# Altium project Tundra_PCB_Project.PrjPcb
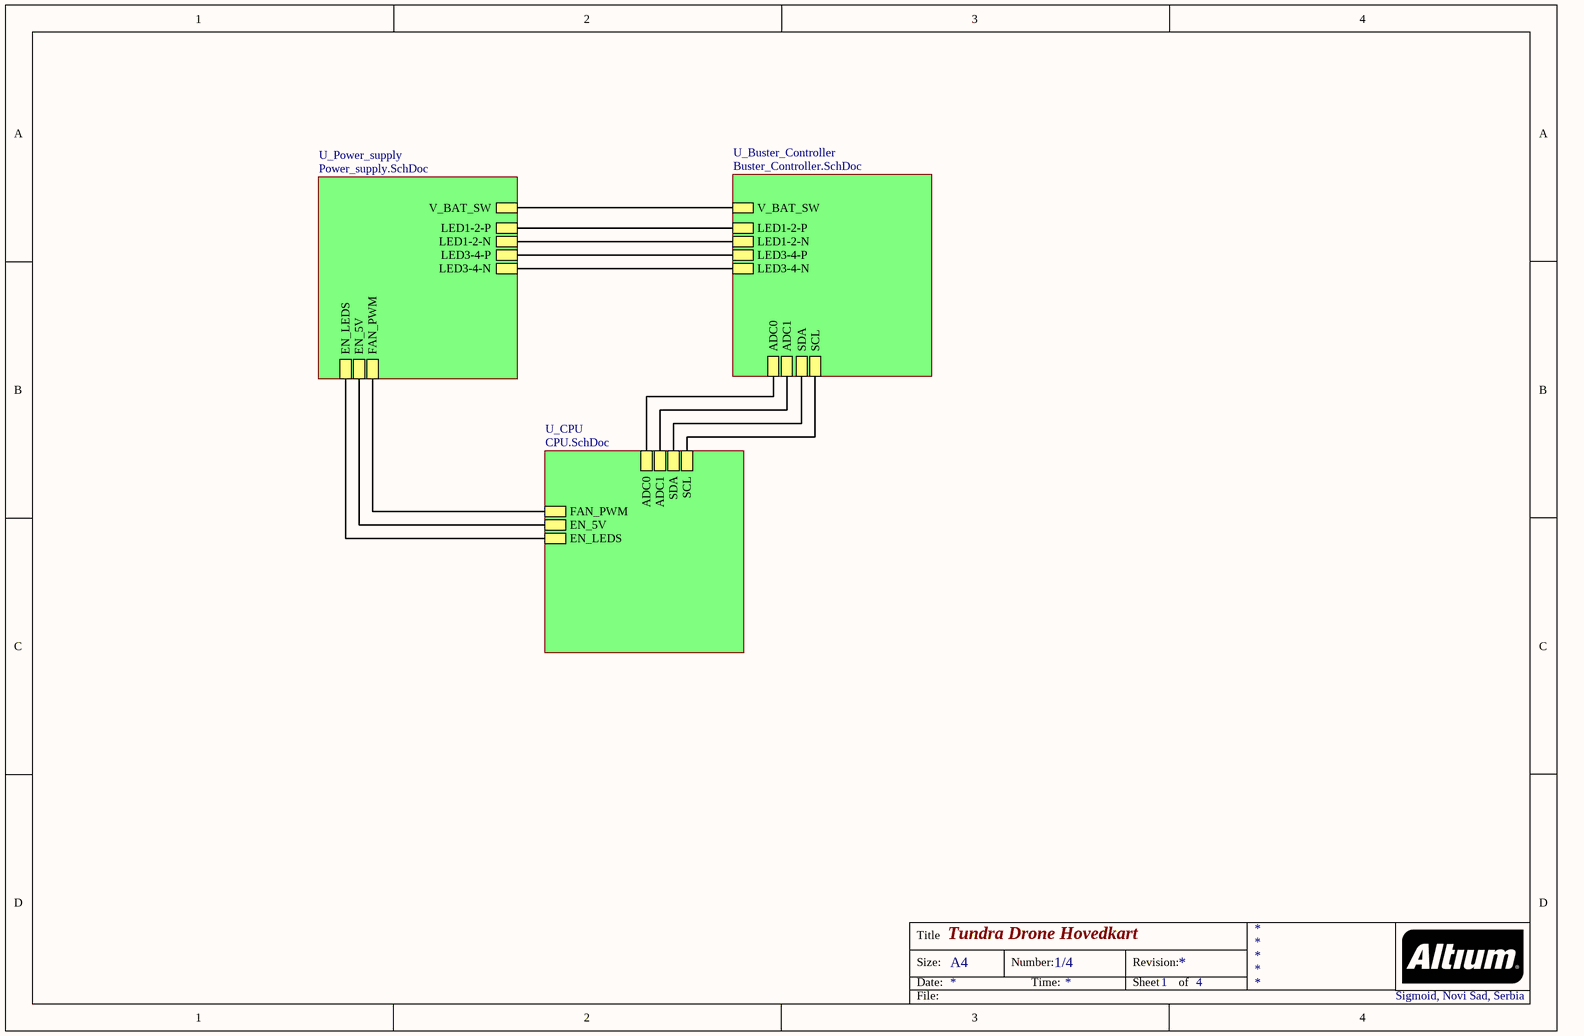
[diagram p0: TUNDRA.SchDoc]
4 sheets, 145 parts. Net scope: hierarchical (ports join the sheet entries above them; power ports are global).
Board file: PCB_TUNDRA.PcbDoc
Sheets:
  TUNDRA.SchDoc
    U_Buster_Controller = Buster_Controller.SchDoc
    U_CPU = CPU.SchDoc
    U_Power_supply = Power_supply.SchDoc

## Sheet TUNDRA.SchDoc: Tundra Drone Hovedkart
size A4; Date: 31.12.2020.; DrawnBy: Sigmoid DOO Novi Sad, Serbia; DocumentNumber: 1/4; SheetNumber: 1; SheetTotal: 4

### Sub-sheets
U_Buster_Controller = Buster_Controller.SchDoc: V_BAT_SW, LED3-4-N, ADC0, ADC1, LED1-2-N, LED1-2-P, LED3-4-P, SDA, SCL
U_CPU = CPU.SchDoc: EN_5V, EN_LEDS, FAN_PWM, ADC0, ADC1, SDA, SCL
U_Power_supply = Power_supply.SchDoc: V_BAT_SW, EN_LEDS, EN_5V, FAN_PWM, LED1-2-P, LED1-2-N, LED3-4-P, LED3-4-N

### Nets
IN1+: sheet U_Buster_Controller/LED1-2-N, sheet U_Power_supply/LED1-2-N
IN2+: sheet U_Buster_Controller/LED3-4-N, sheet U_Power_supply/LED3-4-N
LED1-2-P: sheet U_Buster_Controller/LED1-2-P, sheet U_Power_supply/LED1-2-P
LED3-4-P: sheet U_Buster_Controller/LED3-4-P, sheet U_Power_supply/LED3-4-P
OUT_AMPF1: sheet U_Buster_Controller/ADC0, sheet U_CPU/ADC0
OUT_AMPF2: sheet U_Buster_Controller/ADC1, sheet U_CPU/ADC1
SCL: sheet U_Buster_Controller/SCL, sheet U_CPU/SCL
SDA: sheet U_Buster_Controller/SDA, sheet U_CPU/SDA
NetC1_2: sheet U_Buster_Controller/V_BAT_SW, sheet U_Power_supply/V_BAT_SW
NetQ2_1: sheet U_CPU/EN_LEDS, sheet U_Power_supply/EN_LEDS
NetQ4_1: sheet U_CPU/FAN_PWM, sheet U_Power_supply/FAN_PWM
NetU1_5: sheet U_CPU/EN_5V, sheet U_Power_supply/EN_5V

### Notes on the sheet
- Sigmoid, Novi Sad, Serbia
- Title
- Size:
- Date:
- A4
- Number:
- Time:
- Revision:
- Sheet
- of
- File:

## Sheet Buster_Controller.SchDoc: Buster Controller
size B; DrawnBy: Nikolina Bratic; SheetNumber: 4; SheetTotal: 4; Rule: PcbType=ProtelPcb
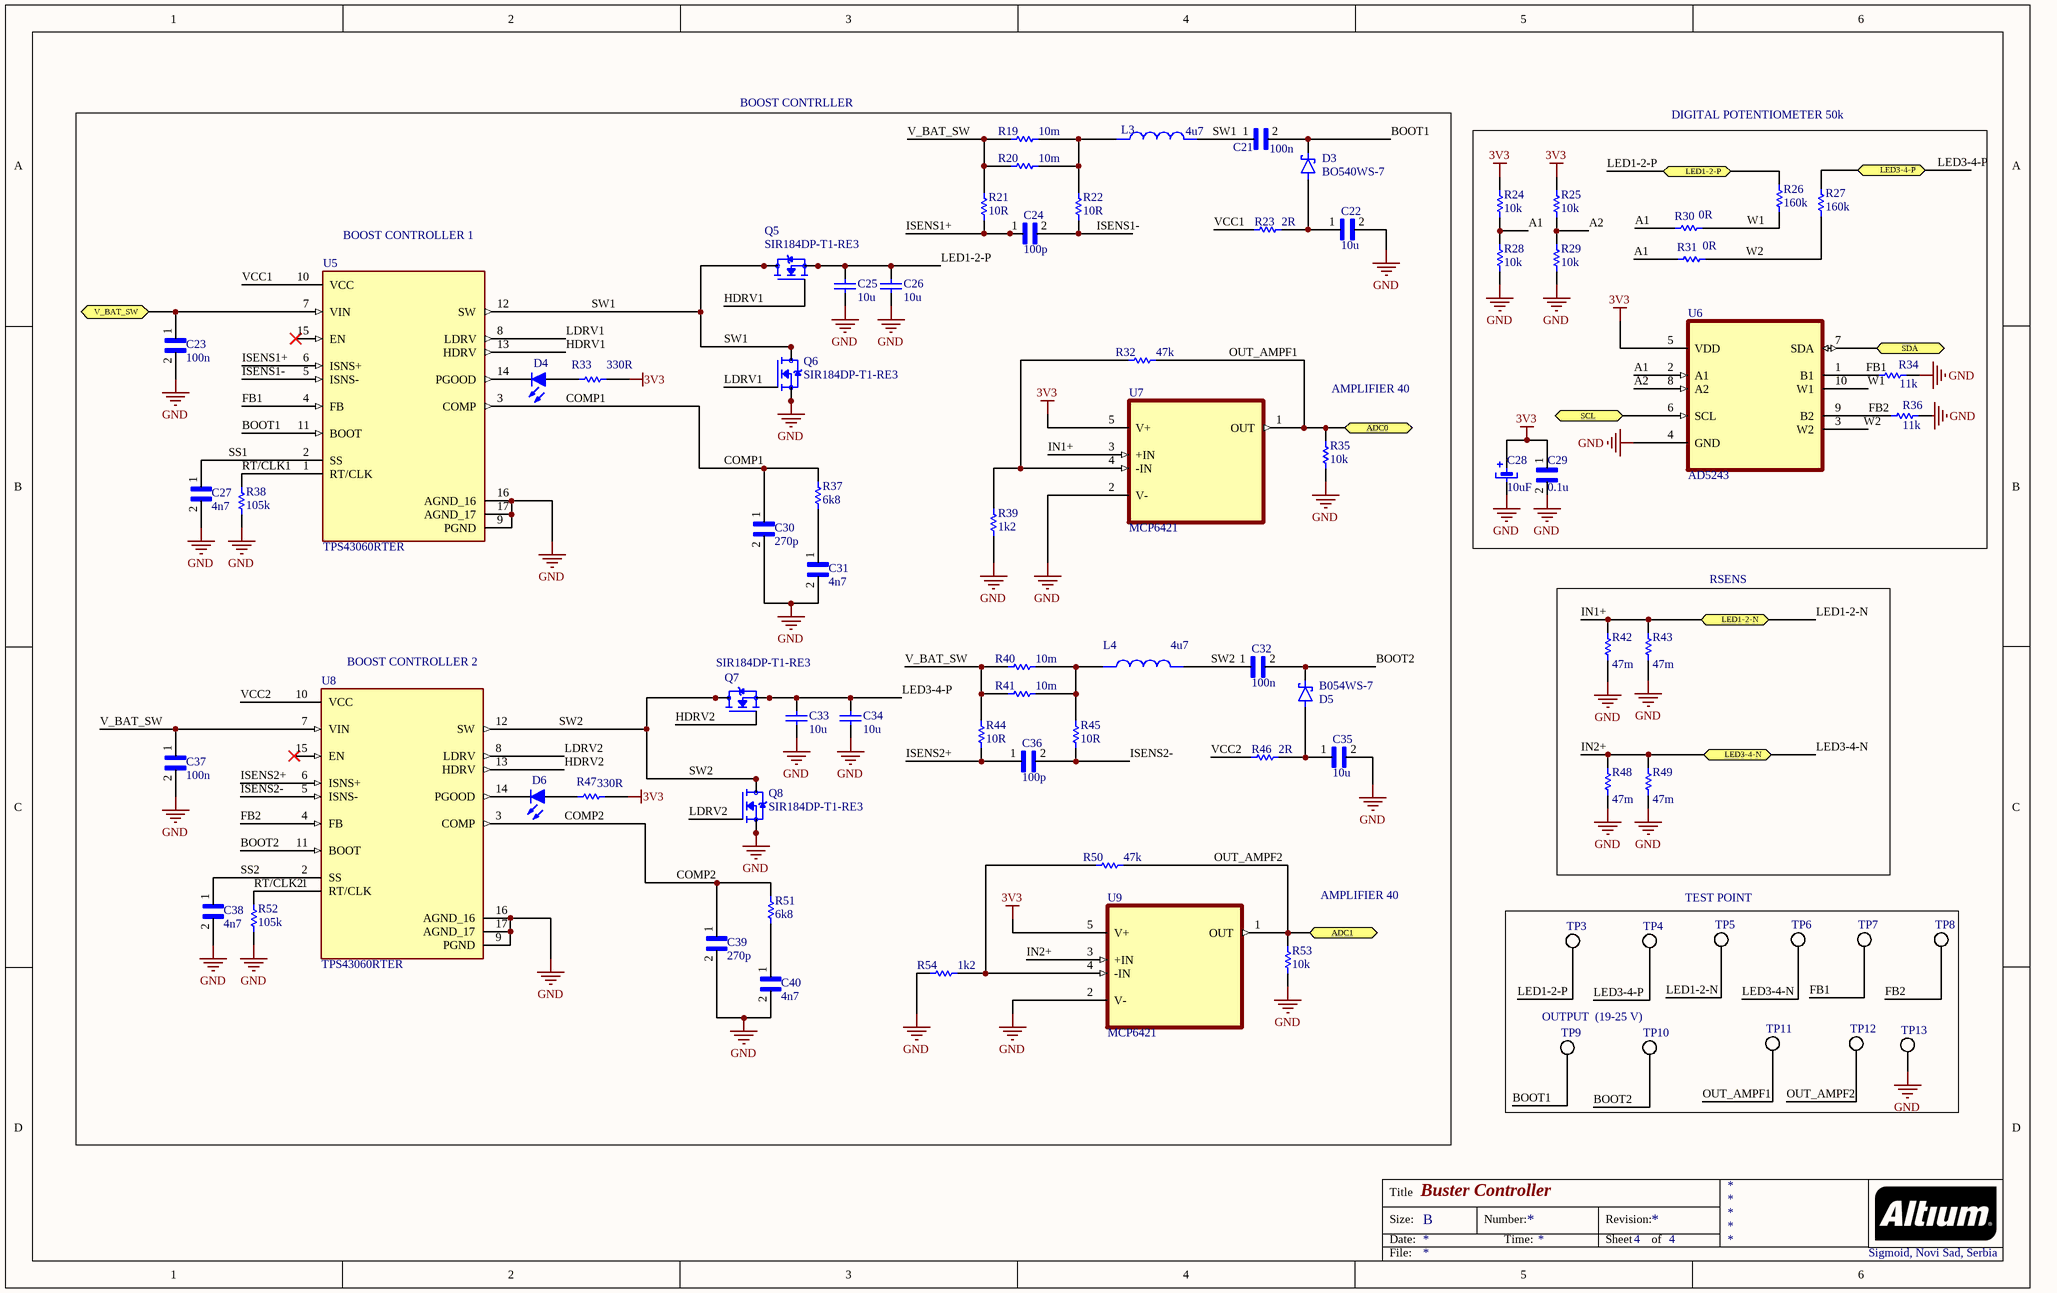
[diagram p1: Buster_Controller.SchDoc]

### Parts
C21  value 100n  [CAPC0402X22N]  (hidden comment: GRM0225C1E4R6CA03L_1)
C22  value 10u  [CAPC0402X22N]  (hidden comment: GRM0225C1E4R6CA03L_1)
C23  value 100n  [CAPC0402X22N]  (hidden comment: GRM0225C1E4R6CA03L_1)
C24  value 100p  [CAPC0402X22N]  (hidden comment: GRM0225C1E4R6CA03L_1)
C25  value 10u  [Capacitor SMD 1206]  (hidden comment: SMD Capacitor)
C26  value 10u  [Capacitor SMD 1206]  (hidden comment: SMD Capacitor)
C27  value 4n7  [CAPC0402X22N]  (hidden comment: GRM0225C1E4R6CA03L_1)
C28  value 10uF  [B Size Capacitor]  (hidden comment: SMD Tantalum Capacitor (B))
C29  value 0.1u  [CAPC0402X22N]  (hidden comment: GRM0225C1E4R6CA03L_1)
C30  value 270p  [CAPC0402X22N]  (hidden comment: GRM0225C1E4R6CA03L_1)
C31  value 4n7  [CAPC0402X22N]  (hidden comment: GRM0225C1E4R6CA03L_1)
C32  value 100n  [CAPC0402X22N]  (hidden comment: GRM0225C1E4R6CA03L_1)
C33  value 10u  [Capacitor SMD 1206]  (hidden comment: SMD Capacitor)
C34  value 10u  [Capacitor SMD 1206]  (hidden comment: SMD Capacitor)
C35  value 10u  [CAPC0402X22N]  (hidden comment: GRM0225C1E4R6CA03L_1)
C36  value 100p  [CAPC0402X22N]  (hidden comment: GRM0225C1E4R6CA03L_1)
C37  value 100n  [CAPC0402X22N]  (hidden comment: GRM0225C1E4R6CA03L_1)
C38  value 4n7  [CAPC0402X22N]  (hidden comment: GRM0225C1E4R6CA03L_1)
C39  value 270p  [CAPC0402X22N]  (hidden comment: GRM0225C1E4R6CA03L_1)
C40  value 4n7  [CAPC0402X22N]  (hidden comment: GRM0225C1E4R6CA03L_1)
D3  BO540WS-7  [SOD323]
D4  SMD LED  [SMD LED Diode]  (value not drawn)
D5  B054WS-7  [SOD323]
D6  SMD LED  [SMD LED Diode]  (value not drawn)
L3  value 4u7  [IND_XAL6060-472ME]  (hidden comment: XAL6060-472ME)
L4  value 4u7  [IND_XAL6060-472ME]  (hidden comment: XAL6060-472ME)
Q5  SIR184DP-T1-RE3  [TRANS_SIR184DP-T1-RE3]
Q6  SIR184DP-T1-RE3  [TRANS_SIR184DP-T1-RE3]
Q7  SIR184DP-T1-RE3  [TRANS_SIR184DP-T1-RE3]
Q8  SIR184DP-T1-RE3  [TRANS_SIR184DP-T1-RE3]
R19  value 10m  [Resistor SMD 1206]  (hidden comment: SMD Resistor)
R20  value 10m  [Resistor SMD 1206]  (hidden comment: SMD Resistor)
R21  value 10R  [RESC1005X35N]  (hidden comment: SMD Resistor)
R22  value 10R  [RESC1005X35N]  (hidden comment: SMD Resistor)
R23  value 2R  [RESC1005X35N]  (hidden comment: SMD Resistor)
R24  value 10k  [RESC1005X35N]  (hidden comment: SMD Resistor)
R25  value 10k  [RESC1005X35N]  (hidden comment: SMD Resistor)
R26  value 160k  [RESC1005X35N]  (hidden comment: SMD Resistor)
R27  value 160k  [RESC1005X35N]  (hidden comment: SMD Resistor)
R28  value 10k  [RESC1005X35N]  (hidden comment: SMD Resistor)
R29  value 10k  [RESC1005X35N]  (hidden comment: SMD Resistor)
R30  value 0R  [RESC1005X35N]  (hidden comment: SMD Resistor)
R31  value 0R  [RESC1005X35N]  (hidden comment: SMD Resistor)
R32  value 47k  [RESC1005X35N]  (hidden comment: SMD Resistor)
R33  value 330R  [RESC1005X35N]  (hidden comment: SMD Resistor)
R34  value 11k  [RESC1005X35N]  (hidden comment: SMD Resistor)
R35  value 10k  [RESC1005X35N]  (hidden comment: SMD Resistor)
R36  value 11k  [RESC1005X35N]  (hidden comment: SMD Resistor)
R37  value 6k8  [RESC1005X35N]  (hidden comment: SMD Resistor)
R38  value 105k  [RESC1005X35N]  (hidden comment: SMD Resistor)
R39  value 1k2  [RESC1005X35N]  (hidden comment: SMD Resistor)
R40  value 10m  [Resistor SMD 1206]  (hidden comment: SMD Resistor)
R41  value 10m  [Resistor SMD 1206]  (hidden comment: SMD Resistor)
R42  value 47m  [Resistor SMD 0603]  (hidden comment: SMD Resistor)
R43  value 47m  [Resistor SMD 0603]  (hidden comment: SMD Resistor)
R44  value 10R  [RESC1005X35N]  (hidden comment: SMD Resistor)
R45  value 10R  [RESC1005X35N]  (hidden comment: SMD Resistor)
R46  value 2R  [RESC1005X35N]  (hidden comment: SMD Resistor)
R47  value 330R  [RESC1005X35N]  (hidden comment: SMD Resistor)
R48  value 47m  [Resistor SMD 0603]  (hidden comment: SMD Resistor)
R49  value 47m  [Resistor SMD 0603]  (hidden comment: SMD Resistor)
R50  value 47k  [RESC1005X35N]  (hidden comment: SMD Resistor)
R51  value 6k8  [RESC1005X35N]  (hidden comment: SMD Resistor)
R52  value 105k  [RESC1005X35N]  (hidden comment: SMD Resistor)
R53  value 10k  [RESC1005X35N]  (hidden comment: SMD Resistor)
R54  value 1k2  [RESC1005X35N]  (hidden comment: SMD Resistor)
TP3  Test Point  [TEST POINT]  (value not drawn)
TP4  Test Point  [TEST POINT]  (value not drawn)
TP5  Test Point  [TEST POINT]  (value not drawn)
TP6  Test Point  [TEST POINT]  (value not drawn)
TP7  Test Point  [TEST POINT]  (value not drawn)
TP8  Test Point  [TEST POINT]  (value not drawn)
TP9  Test Point  [TEST POINT]  (value not drawn)
TP10  Test Point  [TEST POINT]  (value not drawn)
TP11  Test Point  [TEST POINT]  (value not drawn)
TP12  Test Point  [TEST POINT]  (value not drawn)
TP13  Test Point  [TEST POINT]  (value not drawn)
U5  TPS43060RTER  [QFN50P300X300X80-17N]
U6  AD5243  [SOP50P490X110-10N]
U7  MCP6421  [SOT65P210X110-5N]
U8  TPS43060RTER  [QFN50P300X300X80-17N]
U9  MCP6421  [SOT65P210X110-5N]

### Blocks framed on the sheet
DIGITAL POTENTIOMETER 50k: C28 C29 R24-R31 R34 R36 U6
RSENS: R42 R43 R48 R49

### Ports
ADC0, ADC1, LED1-2-N, LED1-2-P, LED3-4-N, LED3-4-P, SCL, SDA, V_BAT_SW

### Nets
3V3: C28.1 C29.1 R24.1 R25.1 R33.2 R47.2 U6.5(VDD) U7.5(V+) U9.5(V+)
GND: C22.2 C23.2 C25.1 C26.1 C27.2 C28.2 C29.2 C30.2 C31.2 C33.1 C34.1 C35.2 C37.2 C38.2 C39.2 C40.2 Q6.1(S) Q6.2(S) Q6.3(S) Q8.1(S) Q8.2(S) Q8.3(S) R28.2 R29.2 R34.1 R35.2 R36.1 R38.2 R39.1 R42.1 R43.1 R48.1 R49.1 R52.2 R53.2 R54.1 TP13.1 U5.9(PGND) U5.16(AGND_16) U5.17(AGND_17) U6.4(GND) U7.2(V-) U8.9(PGND) U8.16(AGND_16) U8.17(AGND_17) U9.2(V-)
A1: R24.2 R28.1 R30.1 R31.1 U6.2(A1)
A2: R25.2 R29.1 U6.8(A2)
BOOT1: C21.2 D3.C(K) TP9.1 U5.11(BOOT)
BOOT2: C32.2 D5.C(K) TP10.1 U8.11(BOOT)
COMP1: C30.1 R37.1 U5.3(COMP)
COMP2: C39.1 R51.1 U8.3(COMP)
FB1: R34.2 TP7.1 U5.4(FB) U6.1(B1)
FB2: R36.2 TP8.1 U6.9(B2) U8.4(FB)
HDRV1: Q5.4(G) U5.13(HDRV)
HDRV2: Q7.4(G) U8.13(HDRV)
IN1+: R42.2 R43.2 TP5.1 U7.3(+IN) ; port LED1-2-N  [also labelled LED1-2-N]
IN2+: R48.2 R49.2 TP6.1 U9.3(+IN) ; port LED3-4-N  [also labelled LED3-4-N]
ISENS1+: C24.1 R21.1 U5.6(ISNS+)
ISENS1-: C24.2 R22.1 U5.5(ISNS-)
ISENS2+: C36.1 R44.1 U8.6(ISNS+)
ISENS2-: C36.2 R45.1 U8.5(ISNS-)
LDRV1: Q6.4(G) U5.8(LDRV)
LDRV2: Q8.4(G) U8.8(LDRV)
LED1-2-P: C25.2 C26.2 Q5.1(S) Q5.2(S) Q5.3(S) R26.1 TP3.1 ; port LED1-2-P
LED3-4-P: C33.2 C34.2 Q7.1(S) Q7.2(S) Q7.3(S) R27.1 TP4.1 ; port LED3-4-P
OUT_AMPF1: R32.2 R35.1 TP11.1 U7.1(OUT) ; port ADC0
OUT_AMPF2: R50.2 R53.1 TP12.1 U9.1(OUT) ; port ADC1
RT/CLK1: R38.1 U5.1(RT/CLK)
RT/CLK2: R52.1 U8.1(RT/CLK)
SCL: U6.6(SCL) ; port SCL
SDA: U6.7(SDA) ; port SDA
SS1: C27.1 U5.2(SS)
SS2: C38.1 U8.2(SS)
SW1: Q5.5(D) Q5.6(D) Q5.7(D) Q5.8(D) Q5.9(D) Q6.5(D) Q6.6(D) Q6.7(D) Q6.8(D) Q6.9(D) U5.12(SW)
SW2: C32.1 L4.2 Q7.5(D) Q7.6(D) Q7.7(D) Q7.8(D) Q7.9(D) Q8.5(D) Q8.6(D) Q8.7(D) Q8.8(D) Q8.9(D) U8.12(SW)
V_BAT_SW: C37.1 R19.1 R20.1 R21.2 R40.1 R41.1 R44.2 U8.7(VIN)
VCC1: R23.2 U5.10(VCC)
VCC2: R46.2 U8.10(VCC)
W1: R26.2 R30.2 U6.10(W1)
W2: R27.2 R31.2 U6.3(W2)
NetC1_2: C23.1 U5.7(VIN) ; port V_BAT_SW
NetC21_1: C21.1 L3.2
NetC22_1: C22.1 D3.A R23.1
NetC31_1: C31.1 R37.2
NetC35_1: C35.1 D5.A R46.1
NetC40_1: C40.1 R51.2
NetD4_1: D4.1(A) R33.1
NetD4_2: D4.2(K) U5.14(PGOOD)
NetD6_1: D6.1(A) R47.1
NetD6_2: D6.2(K) U8.14(PGOOD)
NetL3_1: L3.1 R19.2 R20.2 R22.2
NetL4_1: L4.1 R40.2 R41.2 R45.2
NetR32_1: R32.1 R39.2 U7.4(-IN)
NetR50_1: R50.1 R54.2 U9.4(-IN)

Not connected (* = marked no-connect by the designer): U5 15(EN)*; U8 15(EN)*

### Notes on the sheet
- BOOST CONTRLLER
- (near U5) BOOST CONTROLLER 1
- (near R35) AMPLIFIER 40
- (near U8) BOOST CONTROLLER 2
- AMPLIFIER 40
- TEST POINT
- OUTPUT  (19-25 V)
- Sigmoid, Novi Sad, Serbia
- Labels drawn without touching a wire or pin: SW1
- Title
- Size:
- Date:
- B
- Number:
- Time:
- Revision:
- Sheet
- of
- File:

### Library data of the parts
C21-C24 C27 C29-C32 C35-C40 = GRM0225C1E4R6CA03L_1: SMD Capacitor C0G(EIA) with Capacitance: 4.6pF Tol. 0.25pF. Rated Voltage: 25Vdc; Package: None; Price: None; MP: GRM0225C1E4R6CA03L; Availability: Unavailable
C28 = SMD Tantalum Capacitor (B)_1: Package: SMD 3528 (B)
D3 = MBRS340: Diode, Signal, Schottky  (SOD-323); MF: ON Semiconductor; SnapEDA_Link: https://www.snapeda.com/parts/MBRS340/ON%20Semiconductor/view-part/1473135/?ref=snap; Value: *; MP: MBRS340; Availability: Unavailable; Package: DO-214 ON Semiconductor; DigiKey-Purchase-URL: https://snapeda.com/shop?store=DigiKey&id=1473135; Price: None
D4 D6 = SMD LED Diode: SMD LED (Red, Low Current Type)
D5 = MBRS340: Diode, Signa, Schottky (SOD-323); MF: ON Semiconductor; SnapEDA_Link: https://www.snapeda.com/parts/MBRS340/ON%20Semiconductor/view-part/1473135/?ref=snap; Value: *; MP: MBRS340; Availability: Unavailable; Package: DO-214 ON Semiconductor; DigiKey-Purchase-URL: https://snapeda.com/shop?store=DigiKey&id=1473135; Price: None
L3 L4 = XAL6060-472ME: Power inductor, shielded, 20% tol, SMT, RoHS, halogen f; Package: None; Price: None; MP: XAL6060-472ME; Availability: Unavailable
U5 U8 = TPS43060RTER: Low Iq, 58V, Synchronous Boost Controller w/ Wide Input Voltage & 7.5V Gate Drive for Standard FETs 16-WQFN -40 to 150; MF: Texas Instruments; SnapEDA_Link: https://www.snapeda.com/parts/TPS43060RTER/Texas%20Instruments/view-part/524817/?ref=snap; MP: TPS43060RTER; Availability: Good; Price: None; Value: *; Purchase-URL: https://pricing.snapeda.com/search/part/TPS43060RTER/?ref=eda; Package: WQFN-16 Texas Instruments
U6 = AD5243BRMZ50-RL7: Digital Digital Potentiometer 50k Ohm 2 Circuit 256 Taps I²C Interface 10-MSOP; MP: AD5248BRMZ50-RL7; MF: Analog Devices; Availability: Unavailable; Price: None; Value: *; SnapEDA_Link: https://www.snapeda.com/parts/AD5248BRMZ50-RL7/Analog%20Devices%20Inc./view-part/435262/?ref=snap; Package: MSOP-10 Analog Devices
U7 U9 = MCP6421: General Purpose Amplifier 1 Circuit Rail-to-Rail SC70-5; MF: Analog Devices; MP: LTC2050HVCS5#TRMPBF; Package: SOT-23-5 Analog Devices; Value: *; Price: None; Availability: Warning; Mouser-Purchase-URL: https://snapeda.com/shop?store=Mouser&id=4346571; SnapEDA_Link: https://www.snapeda.com/parts/LTC2050HVCS5%23TRMPBF/Analog%20Devices/view-part/4346571/?ref=snap
Q5-Q8 = SIR184DP-T1-RE3: Package: None; Price: None; Value: *; MP: SIR184DP-T1-RE3; Availability: Unavailable

## Sheet CPU.SchDoc: CPU
size A4; CheckedBy: *Goran Vidakovic; CompanyName: Sigmoid DOO, Novi Sad, Serbia; DrawnBy: *Nikolina Bratic; SheetNumber: 3; SheetTotal: 4
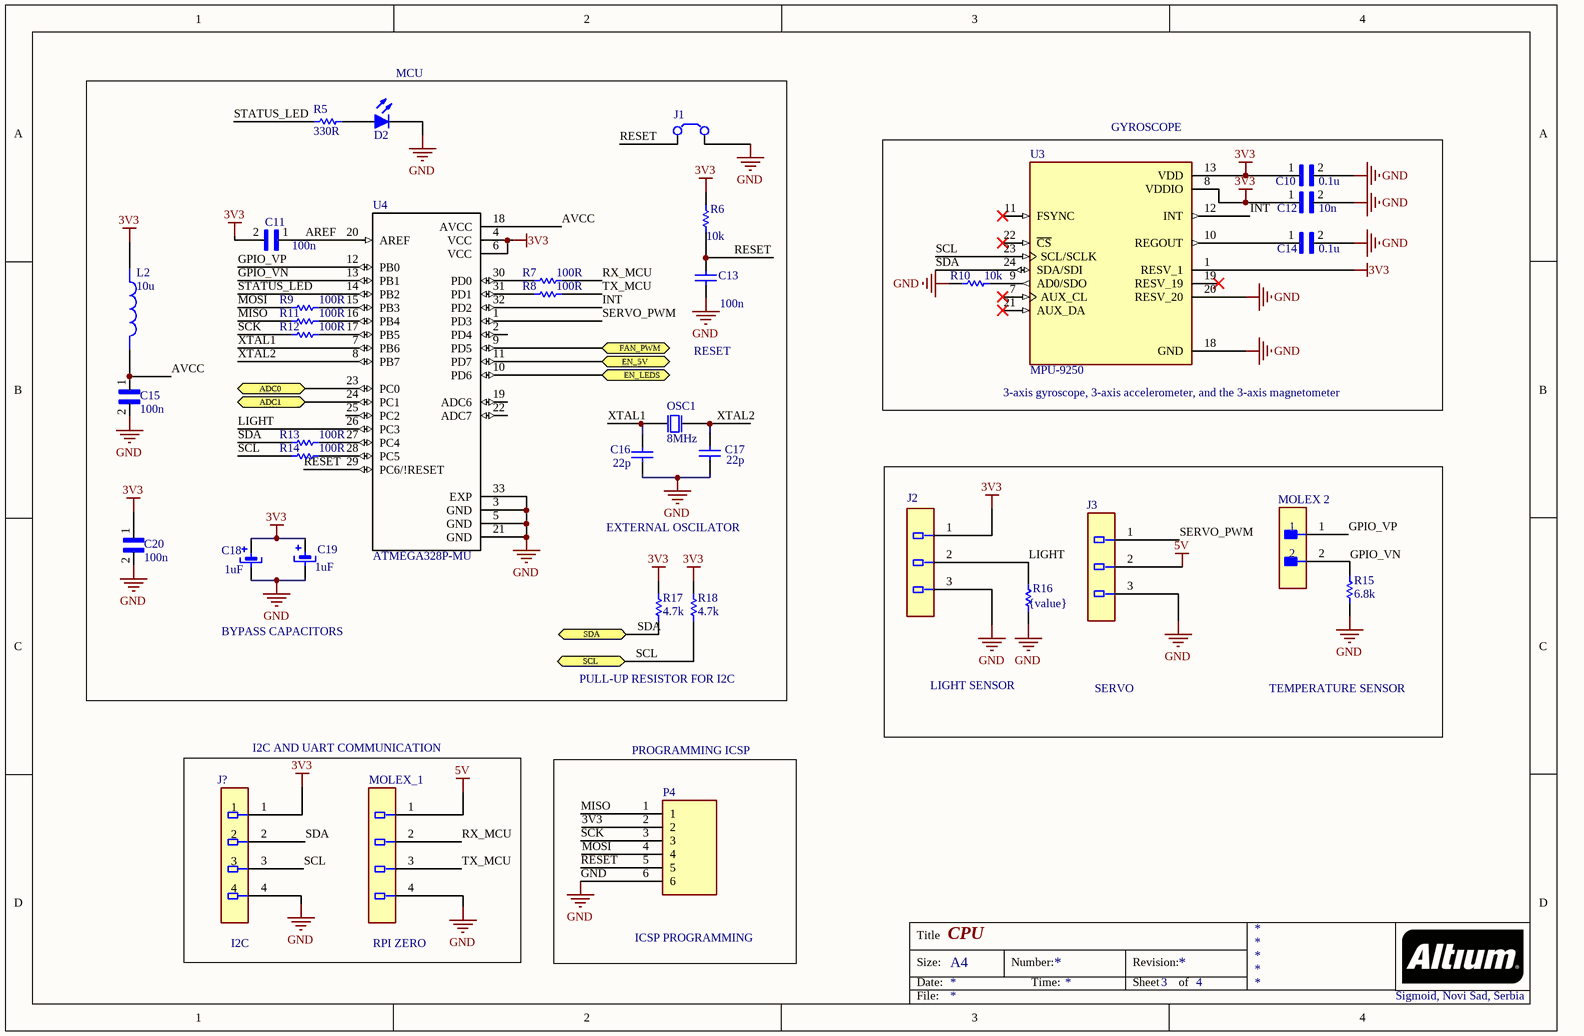
[diagram p2: CPU.SchDoc]

### Parts
C10  value 0.1u  [CAPC0402X22N]  (hidden comment: GRM0225C1E4R6CA03L_1)
C11  value 100n  [CAPC0402X22N]  (hidden comment: GRM0225C1E4R6CA03L_1)
C12  value 10n  [CAPC0402X22N]  (hidden comment: GRM0225C1E4R6CA03L_1)
C13  value 100n  [Capacitor SMD 0603]  (hidden comment: SMD Capacitor)
C14  value 0.1u  [CAPC0402X22N]  (hidden comment: GRM0225C1E4R6CA03L_1)
C15  value 100n  [CAPC0402X22N]  (hidden comment: GRM0225C1E4R6CA03L_1)
C16  value 22p  [Capacitor SMD 0603]  (hidden comment: SMD Capacitor)
C17  value 22p  [Capacitor SMD 0603]  (hidden comment: SMD Capacitor)
C18  value 1uF  [B Size Capacitor]  (hidden comment: SMD Tantalum Capacitor (B))
C19  value 1uF  [B Size Capacitor]  (hidden comment: SMD Tantalum Capacitor (B))
C20  value 100n  [CAPC0402X22N]  (hidden comment: GRM0225C1E4R6CA03L_1)
D2  SMD LED  [SMD LED Diode]  (value not drawn)
J1  Jumper 2 Pole  [Jumper 2 Pole]  (value not drawn)
J2  53253-0370  [Molex_53253-0370_0]  (value not drawn)
J3  SERVO CONNECTOR  [Molex_22-05-1032_0]  (value not drawn)
J?  Connector 4x1 1.27  [Harwin_Inc._M50-3930442_Recommended_Land_Pattern]  (value not drawn)
L2  value 10u  [INDC1608X95N]  (hidden comment: XAL6060-472ME)
MOLEX_1  292161-4  [TE_292161-4_0]  (value not drawn)
MOLEX_2  CONN HEADER VERT 2POS 2MM  [TE_Connectivity_0_MFG]  (value not drawn)
OSC1  value 8MHz  [XTAL_ECS-080-18-23G-JGN-TR]  (hidden comment: SMD Crystal Oscillator)
P4  ICSP PROGRAMMING  [ICSP Programming 6X1 (2mm)]
R5  value 330R  [RESC1005X35N]  (hidden comment: SMD Resistor)
R6  SMD Resistor  [Resistor SMD 0603]  (value not drawn)
R7  value 100R  [Resistor SMD 0603]  (hidden comment: SMD Resistor)
R8  value 100R  [Resistor SMD 0603]  (hidden comment: SMD Resistor)
R9  value 100R  [Resistor SMD 0603]  (hidden comment: SMD Resistor)
R10  value 10k  [Resistor SMD 0603]  (hidden comment: SMD Resistor)
R11  value 100R  [Resistor SMD 0603]  (hidden comment: SMD Resistor)
R12  value 100R  [Resistor SMD 0603]  (hidden comment: SMD Resistor)
R13  value 100R  [Resistor SMD 0603]  (hidden comment: SMD Resistor)
R14  value 100R  [Resistor SMD 0603]  (hidden comment: SMD Resistor)
R15  value 6.8k  [RESC1005X35N]  (hidden comment: SMD Resistor)
R16  value {value}  [Resistor SMD 0603]  (hidden comment: SMD Resistor)
R17  value 4.7k  [RESC1005X35N]  (hidden comment: SMD Resistor)
R18  value 4.7k  [RESC1005X35N]  (hidden comment: SMD Resistor)
U3  MPU-9250  [QFN40P300X300X105-24N]
U4  ATMEGA328P-MU  [QFN50P500X500X100-33N]

### Blocks framed on the sheet
GYROSCOPE: C10 C12 C14 R10 U3
PROGRAMMING ICSP: P4

### Ports
ADC0, ADC1, EN_5V, EN_LEDS, FAN_PWM, SCL, SDA

### Nets
3V3: C10.1 C11.2 C12.1 C18.1 C19.1 C20.1 J2.1 J?.1 L2.1 P4.2 R6.2 R17.2 R18.2 U3.1(RESV_1) U3.8(VDDIO) U3.13(VDD) U4.4(VCC) U4.6(VCC)
5V: J3.2 MOLEX_1.1
GND: C10.2 C12.2 C13.1 C14.2 C15.2 C16.1 C17.1 C18.2 C19.2 C20.2 D2.2(K) J1.2 J2.3 J3.3 J?.4 MOLEX_1.4 P4.6 R10.1 R15.1 R16.1 U3.18(GND) U3.20(RESV_20) U4.3(GND) U4.5(GND) U4.21(GND) U4.33(EXP)
AREF: C11.1 U4.20(AREF)
AVCC: C15.1 L2.2 U4.18(AVCC)
GPIO_VN: MOLEX_2.2 R15.2 U4.13(PB1)
GPIO_VP: MOLEX_2.1 U4.12(PB0)
INT: U3.12(INT) U4.32(PD2)
LIGHT: J2.2 R16.2 U4.26(PC3)
MISO: P4.1 R11.1
MOSI: P4.4 R9.1
OUT_AMPF1: U4.23(PC0) ; port ADC0
OUT_AMPF2: U4.24(PC1) ; port ADC1
RESET: C13.2 J1.1 P4.5 R6.1 U4.29(PC6/!RESET)
RX_MCU: MOLEX_1.2 R7.2
SCK: P4.3 R12.1
SCL: J?.3 R14.1 R18.1 U3.23(SCL/SCLK) ; port SCL
SDA: J?.2 R13.1 R17.1 U3.24(SDA/SDI) ; port SDA
SERVO_PWM: J3.1 U4.1(PD3)
STATUS_LED: R5.2 U4.14(PB2)
TX_MCU: MOLEX_1.3 R8.2
XTAL1: C16.2 OSC1.1(XTAL1) U4.7(PB6)
XTAL2: C17.2 OSC1.2(XTAL2) U4.8(PB7)
NetC14_1: C14.1 U3.10(REGOUT)
NetD2_1: D2.1(A) R5.1
NetQ2_1: U4.10(PD6) ; port EN_LEDS
NetQ4_1: U4.9(PD5) ; port FAN_PWM
NetR7_1: R7.1 U4.30(PD0)
NetR8_1: R8.1 U4.31(PD1)
NetR9_2: R9.2 U4.15(PB3)
NetR10_2: R10.2 U3.9(AD0/SDO)
NetR11_2: R11.2 U4.16(PB4)
NetR12_2: R12.2 U4.17(PB5)
NetR13_2: R13.2 U4.27(PC4)
NetR14_2: R14.2 U4.28(PC5)
NetU1_5: U4.11(PD7) ; port EN_5V

Not connected (* = marked no-connect by the designer): U3 7(AUX_CL)* 11(FSYNC)* 19(RESV_19)* 21(AUX_DA)* 22(~{CS})*; U4 2(PD4) 19(ADC6) 22(ADC7) 25(PC2)

### Notes on the sheet
- (near D2) MCU
- RESET
- (near U3) 3-axis gyroscope, 3-axis accelerometer, and the 3-axis magnetometer
- EXTERNAL OSCILATOR
- BYPASS CAPACITORS
- PULL-UP RESISTOR FOR I2C
- LIGHT SENSOR
- SERVO
- TEMPERATURE SENSOR
- I2C AND UART COMMUNICATION
- (near J?) I2C
- (near MOLEX_1) RPI ZERO
- Sigmoid, Novi Sad, Serbia
- Title
- Size:
- Date:
- A4
- Number:
- Time:
- Revision:
- Sheet
- of
- File:
- (in symbol SMD Resistor) 10k

### Library data of the parts
C10-C12 C14 C15 C20 = GRM0225C1E4R6CA03L_1: as C21 on sheet Buster_Controller; Package: None; Price: None; MP: GRM0225C1E4R6CA03L; Availability: Unavailable
C18 C19 = SMD Tantalum Capacitor (B)_1: Package: SMD 3528 (B)
D2 = SMD LED Diode: SMD LED (Red, Low Current Type)
J3 = 22-05-1032
J? = M50-3930442
L2 = XAL6060-472ME: as L3 on sheet Buster_Controller; Package: None; Price: None; MP: XAL6060-472ME; Availability: Unavailable
MOLEX_1 = 292161-4: Post Header Assembly, 4 Position, Vertical, 2mm Pitch, DIP Standard Type
MOLEX_2 = 53253-0270: Connector Header Through Hole 2 position 0.079" (2.00mm)
P4 = ICSP PROGRAMMING: POGO con6, pitch 2mm, Fi cc 1.5mm; MP: 2267063-6; Package: None; Price: None; Value: *; Availability: Unavailable
U3 = MPU-9250: Accelerometer, Gyroscope, Magnetometer, 9 Axis Sensor IÂ²C, SPI Output; MF: TDK InvenSense; SnapEDA_Link: https://www.snapeda.com/parts/MPU-9250/TDK%20InvenSense/view-part/4652549/?ref=snap; Value: *; MP: MPU-9250; Availability: Unavailable; Package: TFQFN-24 TDK InvenSense; Price: None
U4 = ATMEGA328P-MU: AVR AVRÂ® ATmega Microcontroller IC 8-Bit 20MHz 32KB (16K x 16) FLASH 32-VQFN (5x5); MF: Microchip; Value: *; Package: VQFN-32 Microchip; Price: None; MP: ATMEGA328P-MU; Availability: Good; SnapEDA_Link: https://www.snapeda.com/parts/ATMEGA328P-MU/Microchip/view-part/649548/?ref=snap; Check_prices: https://www.snapeda.com/parts/ATMEGA328P-MU/Microchip/view-part/649548/?ref=eda; Purchase-URL: https://pricing.snapeda.com/search/part/ATMEGA328P-MU/?ref=eda

## Sheet Power_supply.SchDoc: Power supply
size A4; Date: 31.12.2020.; CheckedBy: Goran Vidakovic; CompanyName: Sigmoid DOO, Novi Sad; DrawnBy: Nikolina Bratic; SheetNumber: 2; SheetTotal: 4
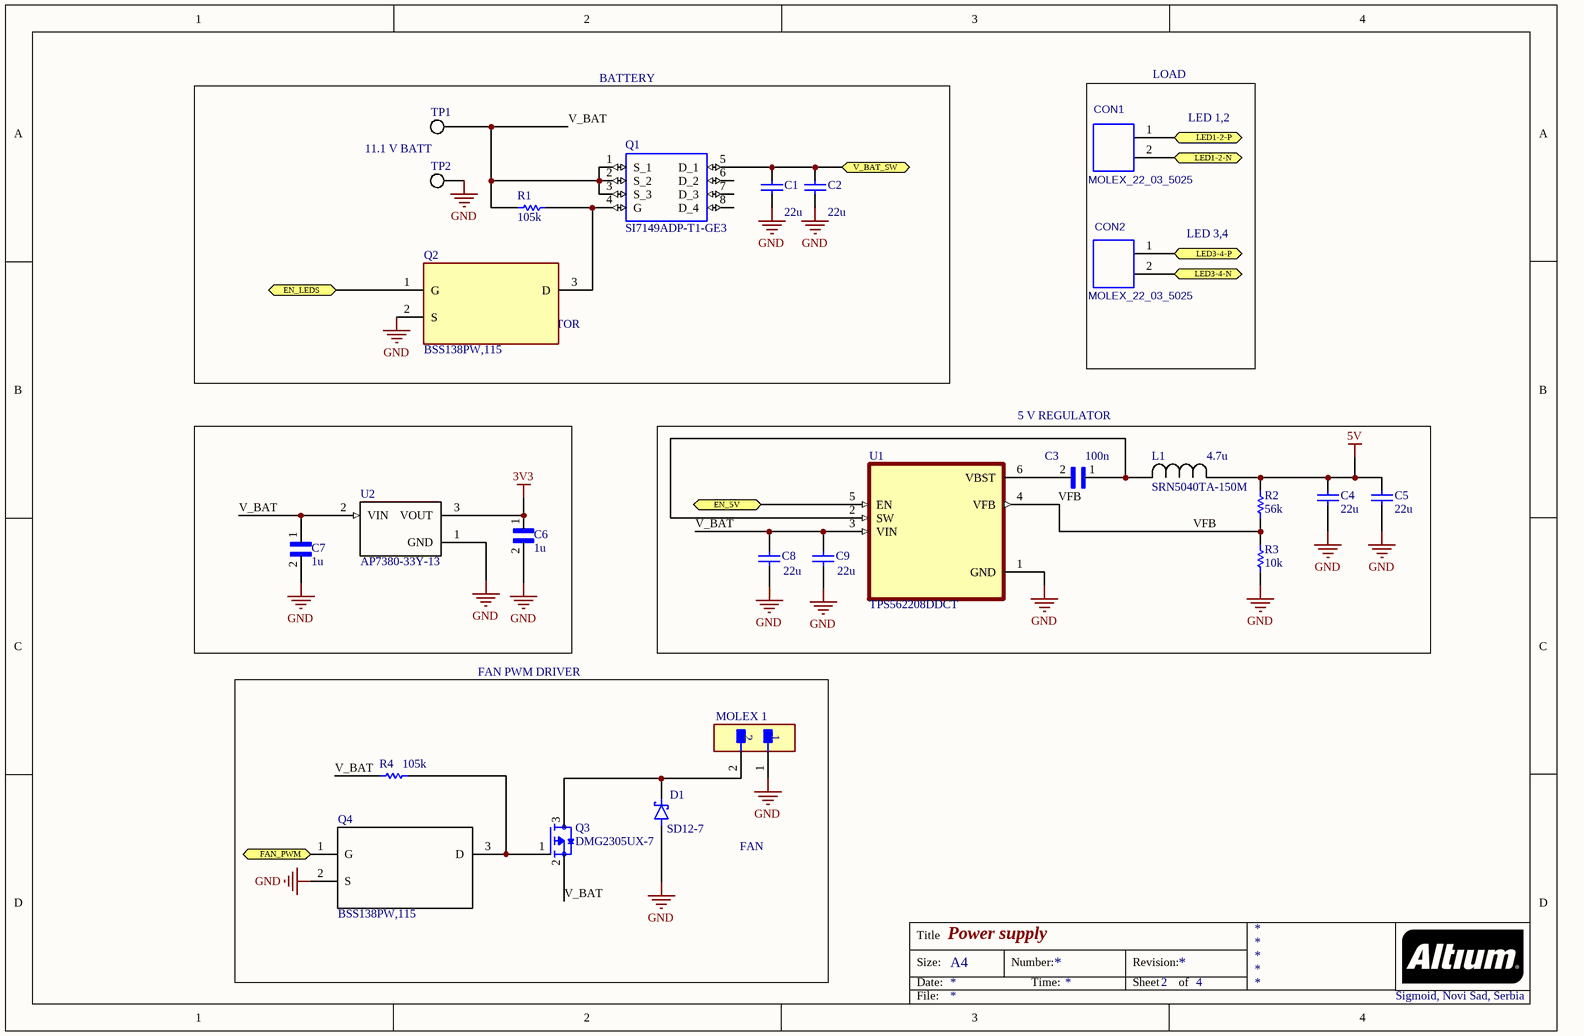
[diagram p3: Power_supply.SchDoc]

### Parts
C1  value 22u  [Capacitor SMD 1206]  (hidden comment: SMD Capacitor)
C2  value 22u  [Capacitor SMD 1206]  (hidden comment: SMD Capacitor)
C3  value 100n  [CAPC0402X22N]  (hidden comment: GRM0225C1E4R6CA03L_1)
C4  value 22u  [Capacitor SMD 0603]  (hidden comment: SMD Capacitor)
C5  value 22u  [Capacitor SMD 0603]  (hidden comment: SMD Capacitor)
C6  value 1u  [CAPC0402X22N]  (hidden comment: GRM0225C1E4R6CA03L_1)
C7  value 1u  [CAPC0402X22N]  (hidden comment: GRM0225C1E4R6CA03L_1)
C8  value 22u  [Capacitor SMD 1206]  (hidden comment: SMD Capacitor)
C9  value 22u  [Capacitor SMD 1206]  (hidden comment: SMD Capacitor)
CON1  MOLEX_22_03_5025  [MOLEX_22-03-5025]
CON2  MOLEX_22_03_5025  [MOLEX_22-03-5025]
D1  SD12-7  [SOD323]
L1  SRN5040TA-150M  [IND_A-150M]
MOLEX_1  CONN HEADER VERT 2POS 2MM  [TE_Connectivity_0_MFG]  (value not drawn)
Q1  SI7149ADP-T1-GE3  [POWERPAKSO-8]
Q2  BSS138PW,115  [SOT65P210X110-3N]
Q3  DMG2305UX-7  [SOT91P240X110-3N_DMG2305UX-7 - duplicate]
Q4  BSS138PW,115  [SOT65P210X110-3N]
R1  SMD Resistor  [RESC1005X35N]  (value not drawn)
R2  value 56k  [RESC1005X35N]  (hidden comment: SMD Resistor)
R3  value 10k  [RESC1005X35N]  (hidden comment: SMD Resistor)
R4  value 105k  [Resistor SMD 0603]  (hidden comment: SMD Resistor)
TP1  Test Point  [TEST POINT]  (value not drawn)
TP2  Test Point  [TEST POINT]  (value not drawn)
U1  TPS562208DDCT  [SOT95P280X110-6N]
U2  AP7380-33Y-13  [VREG_AP7380-33Y-13]

### Blocks framed on the sheet
5 V REGULATOR: C3-C5 C8 C9 L1 R2 R3 U1

### Ports
EN_5V, EN_LEDS, FAN_PWM, LED1-2-N, LED1-2-P, LED3-4-N, LED3-4-P, V_BAT_SW

### Nets
3V3: C6.1 U2.3(VOUT)
5V: C4.2 C5.2 L1.1 R2.2
GND: C1.1 C2.1 C4.1 C5.1 C6.2 C7.2 C8.1 C9.1 D1.A MOLEX_1.1 Q2.2(S) Q4.2(S) R3.1 TP2.1 U1.1(GND) U2.1(GND)
IN1+: CON1.2 ; port LED1-2-N
IN2+: CON2.2 ; port LED3-4-N
LED1-2-P: CON1.1 ; port LED1-2-P
LED3-4-P: CON2.1 ; port LED3-4-P
V_BAT: C7.1 C8.2 C9.2 Q1.1(S_1) Q1.2(S_2) Q1.3(S_3) Q3.2(S) R1.2 R4.1 TP1.1 U1.3(VIN) U2.2(VIN)
VFB: R2.1 R3.2 U1.4(VFB)
NetC1_2: C1.2 C2.2 Q1.5(D_1) ; port V_BAT_SW
NetC3_1: C3.1 L1.2 U1.2(SW)
NetC3_2: C3.2 U1.6(VBST)
NetD1_C: D1.C(K) MOLEX_1.2 Q3.3(D)
NetQ1_4: Q1.4(G) Q2.3(D) R1.1
NetQ2_1: Q2.1(G) ; port EN_LEDS
NetQ3_1: Q3.1(G) Q4.3(D) R4.2
NetQ4_1: Q4.1(G) ; port FAN_PWM
NetU1_5: U1.5(EN) ; port EN_5V

Not connected (* = marked no-connect by the designer): Q1 6(D_2) 7(D_3) 8(D_4)

### Notes on the sheet
- BATTERY
- LOAD
- 11.1 V BATT
- LED 1,2
- LED 3,4
- (near Q2) 3.3 V REGULATOR
- FAN PWM DRIVER
- FAN
- Sigmoid, Novi Sad, Serbia
- Title
- Size:
- Date:
- A4
- Number:
- Time:
- Revision:
- Sheet
- of
- File:
- (in symbol SRN5040TA-150M) 4.7u

### Library data of the parts
C3 C6 C7 = GRM0225C1E4R6CA03L_1: as C21 on sheet Buster_Controller; Package: None; Price: None; MP: GRM0225C1E4R6CA03L; Availability: Unavailable
CON1 CON2 = KONEKTOR 2-POLNI_X8Y6: KONEKTOR 2 MOLEX; Value: *
D1 = MBRS340: Diode, Signal, TVS, 12V, Unidir. (SOD323); MF: ON Semiconductor; SnapEDA_Link: https://www.snapeda.com/parts/MBRS340/ON%20Semiconductor/view-part/1473135/?ref=snap; Value: *; MP: MBRS340; Availability: Unavailable; Package: DO-214 ON Semiconductor; DigiKey-Purchase-URL: https://snapeda.com/shop?store=DigiKey&id=1473135; Price: None
L1 = SRN5040TA-150M: Fixed Inductors 3.3uH 20% SMD 5040; Vendor: Bourns Electronics; Built_By: EMA_Matt; SourceLibrary: Bourns_Electronics_2019-12-18; Type: DEV; Manufacturer_Part_Number: SRN5040TA-150M; Copyright: Copyright (C) 2018 Accelerated Designs. All rights reserved; RefDes: RefDes
MOLEX_1 = 53253-0270: as MOLEX_2 on sheet CPU
Q1 = SI7149ADP-T1-GE3: P-Channel 30V 50A (Tc) 5W (Ta), 48W (Tc) Surface Mount PowerPAKÂ® SO-8; MF: Vishay Siliconix; Availability: Good; Purchase-URL: https://pricing.snapeda.com/search/part/SI7149ADP-T1-GE3/?ref=eda; SnapEDA_Link: https://www.snapeda.com/parts/SI7149ADP-T1-GE3/Vishay%20Siliconix/view-part/415842/?ref=snap; MP: SI7149ADP-T1-GE3; Price: None; Value: *; Check_prices: https://www.snapeda.com/parts/SI7149ADP-T1-GE3/Vishay%20Siliconix/view-part/415842/?ref=eda; Package: SO-8 Vishay
Q2 Q4 = BSS138PW,115: N-Channel 60V 320mA _Ta_ 260mW _Ta_, 830mW _Tc_ Surface Mount SC-70; MF: Nexperia USA; Digi-Key_Part_Number: 1727-1143-1-ND; SnapEDA_Link: https://www.snapeda.com/parts/BSS138PW%2C115/Nexperia%20USA%20Inc./view-part/209423/?ref=snap; Package: SOT-323 NXP Semiconductors; MP: BSS138PW,115; Digi-Key_Purchase_URL: https://www.digikey.com/product-detail/en/nexperia-usa-inc/BSS138PW,115/1727-1143-1-ND/4162472?utm_source=snapeda&utm_medium=aggregator&utm_campaign=symbol; Value: *
Q3 = DMG2305UX-7: P-Channel 20V 4.2A _Ta_ 1.4W _Ta_ Surface Mount SOT-23; MF: Power Analog Micro; SnapEDA_Link: https://www.snapeda.com/parts/DMG2305UX-7/Power%20Analog%20Micro/view-part/174848/?ref=snap; Price: None; MP: DMG2305UX-7; Package: TO-236-3 Power Analog Micro; Value: *; Availability: Unavailable
U1 = TPS562208DDCT: 4.5 V to 17 V input, 2 A output, synchronous step-down converter in FCCM mode 6-SOT-23-THIN -40 to 125; MF: Texas Instruments; Value: *; MP: TPS562208DDCT; Availability: Good; DigiKey-Purchase-URL: https://snapeda.com/shop?store=DigiKey&id=652146; SnapEDA_Link: https://www.snapeda.com/parts/TPS562208DDCT/Texas%20Instruments/view-part/652146/?ref=snap; Price: None; Mouser-Purchase-URL: https://snapeda.com/shop?store=Mouser&id=652146; Texas_Instruments-Purchase-URL: https://snapeda.com/shop?store=Texas+Instruments&id=652146; Package: SOT-23-THN-6 Texas Instruments
U2 = AP7380-33Y-13: LDO Regulator Pos 3.3V 0.15A 4-Pin(3+Tab) SOT-89 T/R; MF: Diodes Incorporated; MP: AP7380-33Y-13; SnapEDA_Link: https://www.snapeda.com/parts/AP7380-33Y-13/Diodes%20Inc./view-part/4834117/?ref=snap; Value: *; Arrow_Electronics-Purchase-URL: https://snapeda.com/shop?store=Arrow+Electronics&id=4834117; Package: None; Price: None; Mouser-Purchase-URL: https://snapeda.com/shop?store=Mouser&id=4834117; Availability: Unavailable
R1-R4 = SMD Resistor
  R1: 105k: 105k

## Nets that join several sheets
3V3: Buster_Controller (9 pins), CPU (18 pins), Power_supply (C6.1 U2.3)
5V: CPU (J3.2 MOLEX_1.1), Power_supply (C4.2 C5.2 L1.1 R2.2)
GND: Buster_Controller (46 pins), CPU (26 pins), Power_supply (16 pins)
IN1+: Buster_Controller (R42.2 R43.2 TP5.1 U7.3), Power_supply (CON1.2)
IN2+: Buster_Controller (R48.2 R49.2 TP6.1 U9.3), Power_supply (CON2.2)
LED1-2-P: Buster_Controller (7 pins), Power_supply (CON1.1)
LED3-4-P: Buster_Controller (7 pins), Power_supply (CON2.1)
NetC1_2: Buster_Controller (C23.1 U5.7), Power_supply (C1.2 C2.2 Q1.5)
NetQ2_1: CPU (U4.10), Power_supply (Q2.1)
NetQ4_1: CPU (U4.9), Power_supply (Q4.1)
NetU1_5: CPU (U4.11), Power_supply (U1.5)
OUT_AMPF1: Buster_Controller (R32.2 R35.1 TP11.1 U7.1), CPU (U4.23)
OUT_AMPF2: Buster_Controller (R50.2 R53.1 TP12.1 U9.1), CPU (U4.24)
SCL: Buster_Controller (U6.6), CPU (J?.3 R14.1 R18.1 U3.23)
SDA: Buster_Controller (U6.7), CPU (J?.2 R13.1 R17.1 U3.24)